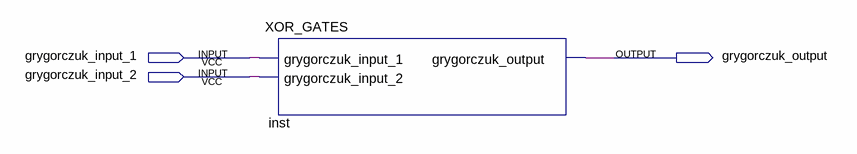
[diagram p0: schematic sheet]
// Quartus schematic XOR_SYMBOL.bdf as structural Verilog: 1 symbols, 3 pins
module XOR_SYMBOL (
  input  grygorczuk_input_1,
  input  grygorczuk_input_2,
  output grygorczuk_output
);

  XOR_GATES inst (
    .grygorczuk_input_1(grygorczuk_input_1), .grygorczuk_input_2(grygorczuk_input_2),
    .grygorczuk_output(grygorczuk_output));
endmodule
